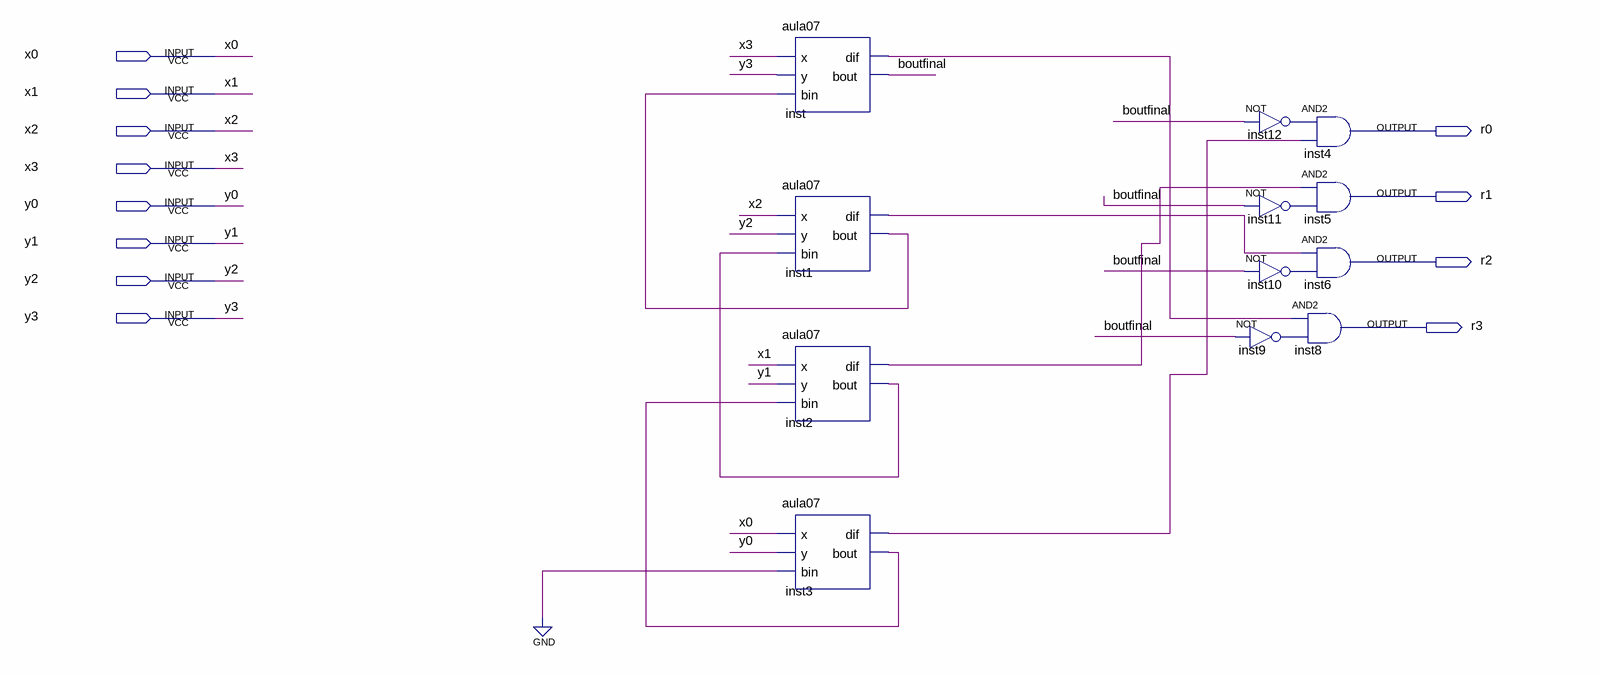
[diagram p0: schematic sheet]
// Quartus schematic aula08.bdf as structural Verilog: 12 symbols, 12 pins
module aula08 (
  input  x0,
  input  x1,
  input  x2,
  input  x3,
  input  y0,
  input  y1,
  input  y2,
  input  y3,
  output r0,
  output r1,
  output r2,
  output r3
);

  wire boutfinal, inst1_bout, inst1_dif, inst2_bout, inst2_dif, inst3_bout, inst3_dif, inst9_out, inst10_out,
       inst11_out, inst12_out, inst_dif;

  aula07 inst (.x(x3), .y(y3), .bin(inst1_bout), .dif(inst_dif), .bout(boutfinal));
  aula07 inst1 (.x(x2), .y(y2), .bin(inst2_bout), .dif(inst1_dif), .bout(inst1_bout));
  aula07 inst2 (.x(x1), .y(y1), .bin(inst3_bout), .dif(inst2_dif), .bout(inst2_bout));
  aula07 inst3 (.x(x0), .y(y0), .bin(1'b0), .dif(inst3_dif), .bout(inst3_bout));
  not inst12 (inst12_out, boutfinal);
  not inst11 (inst11_out, boutfinal);
  not inst10 (inst10_out, boutfinal);
  not inst9 (inst9_out, boutfinal);
  and inst4 (r0, inst12_out, inst3_dif);
  and inst5 (r1, inst2_dif, inst11_out);
  and inst6 (r2, inst1_dif, inst10_out);
  and inst8 (r3, inst_dif, inst9_out);
endmodule
